# EAGLE design motordriver_output_board_01 (EAGLE 6.5.0)
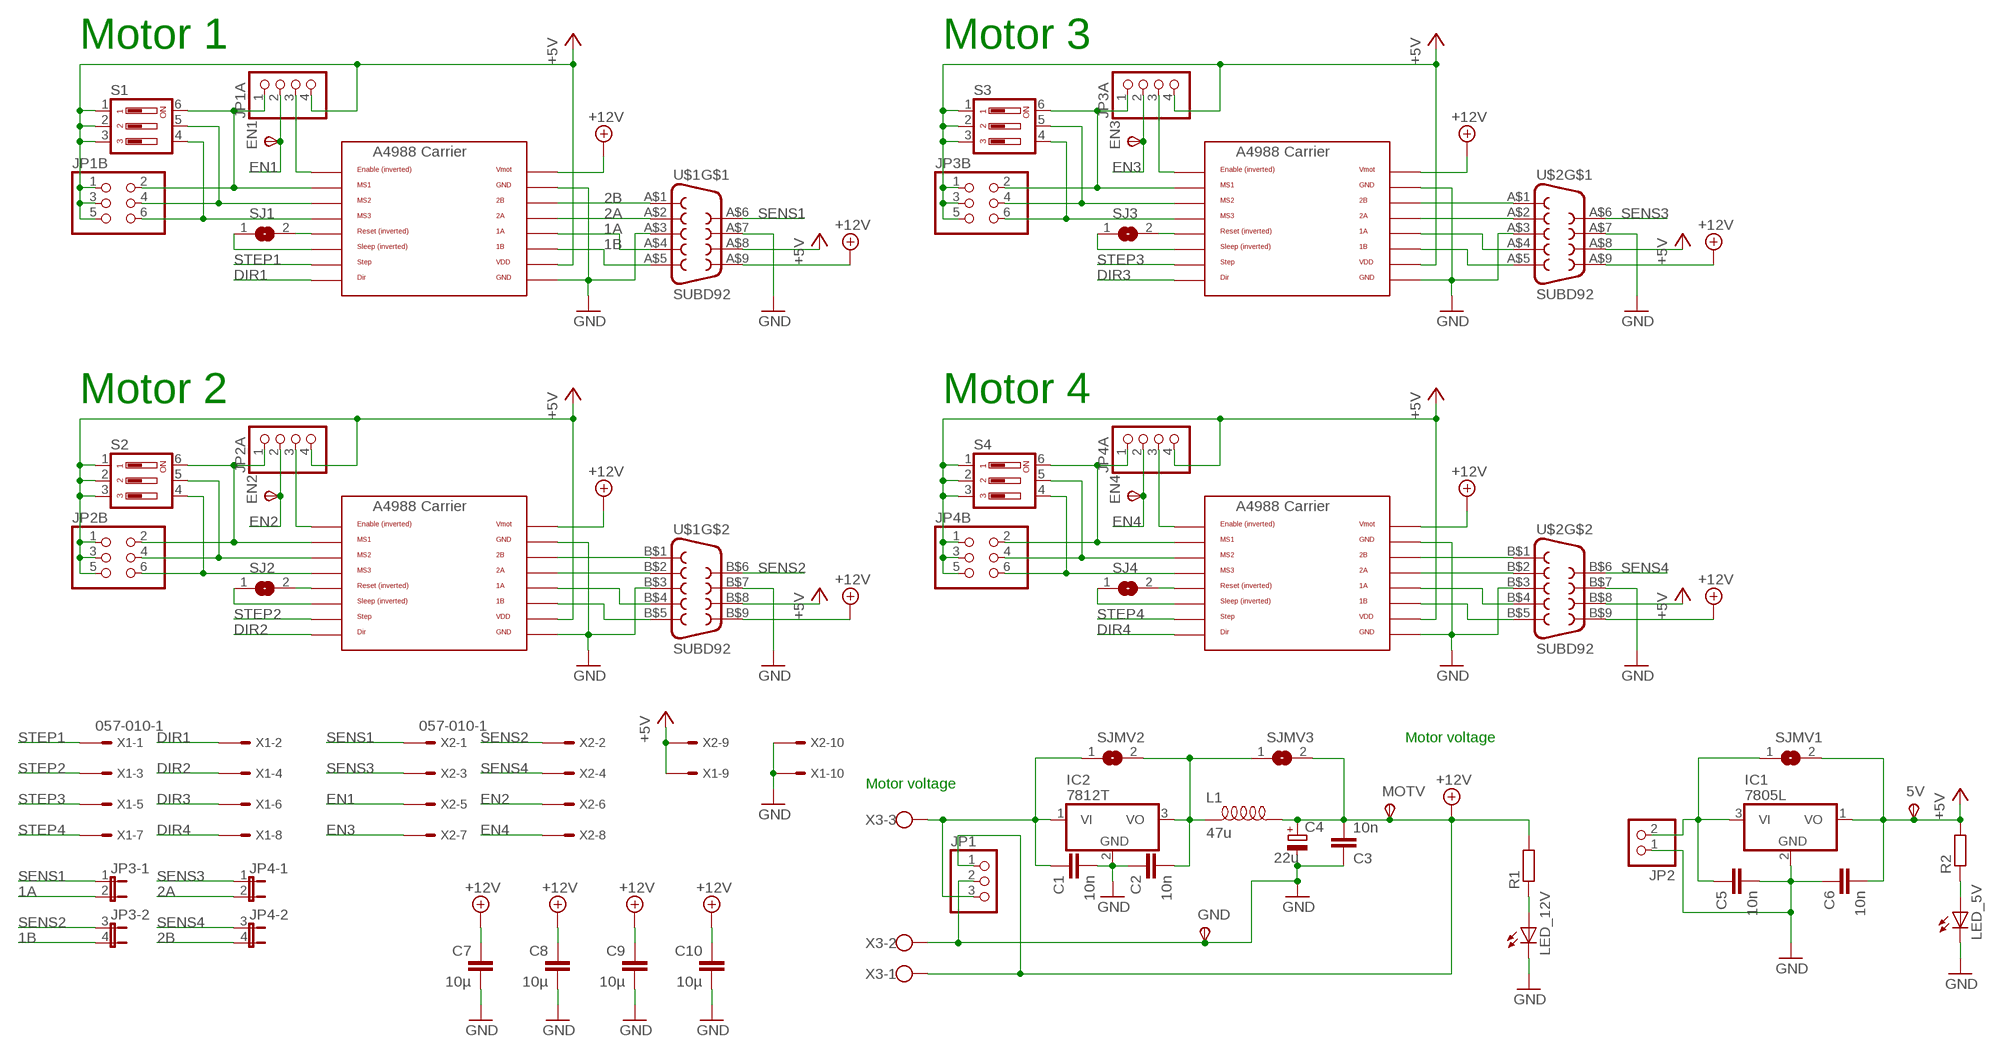
[diagram p0: schematic, sheet 1]

## Parts
5V  TPSPAD1-13  [P1-13]
C1  10n  C-EUC0805  [C0805]
C2  10n  C-EUC0805  [C0805]
C3  10n  C-EUC0805  [C0805]
C4  22u  CPOL-EU153CLV-0605  [153CLV-0605]
C5  10n  C-EUC0805  [C0805]
C6  10n  C-EUC0805  [C0805]
C7  10µ  C-EUC0805  [C0805]
C8  10µ  C-EUC0805  [C0805]
C9  10µ  C-EUC0805  [C0805]
C10  10µ  C-EUC0805  [C0805]
EN1  TPSPAD1-13  [P1-13]
EN2  TPSPAD1-13  [P1-13]
EN3  TPSPAD1-13  [P1-13]
EN4  TPSPAD1-13  [P1-13]
GND  TPSPAD1-13  [P1-13]
IC1  7805L  [TO92]
IC2  7812T  [TO220H]
JP1  PINHD-1X3  [1X03]
JP1A  PINHD-1X4  [1X04]
JP1B  PINHD-2X3  [2X03]
JP2  PINHD-1X2  [1X02]
JP2A  PINHD-1X4  [1X04]
JP2B  PINHD-2X3  [2X03]
JP3  JP2QE  [JP2Q]
JP3A  PINHD-1X4  [1X04]
JP3B  PINHD-2X3  [2X03]
JP4  JP2QE  [JP2Q]
JP4A  PINHD-1X4  [1X04]
JP4B  PINHD-2X3  [2X03]
L1  47u  A814AY-220M  [D10F]
LED_5V  LEDCHIP-LED0805  [CHIP-LED0805]
LED_12V  LEDCHIP-LED0805  [CHIP-LED0805]
MOTDRV1  A4988BREAKOUT  [A4988BREAKOUT]
MOTDRV2  A4988BREAKOUT  [A4988BREAKOUT]
MOTDRV3  A4988BREAKOUT  [A4988BREAKOUT]
MOTDRV4  A4988BREAKOUT  [A4988BREAKOUT]
MOTV  TPSPAD1-13  [P1-13]
R1  R-EU_M0805  [M0805]
R2  R-EU_M0805  [M0805]
S1  DIP03YL  [DIP03YL]
S2  DIP03YL  [DIP03YL]
S3  DIP03YL  [DIP03YL]
S4  DIP03YL  [DIP03YL]
SJ1  SJ  [SJ]
SJ2  SJ  [SJ]
SJ3  SJ  [SJ]
SJ4  SJ  [SJ]
SJMV1  SJW  [SJW]
SJMV2  SJW  [SJW]
SJMV3  SJW  [SJW]
U$1  SUBD92  [SUBD9-2]
U$2  SUBD92  [SUBD9-2]
X1  057-010-1  [057-010-1]
X2  057-010-1  [057-010-1]
X3  W237-103  [W237-103]

## Nets
1A: JP3.2 MOTDRV1.1A U$1.A$4
1A4: MOTDRV4.1A U$2.B$4
1B: JP3.4 MOTDRV1.1B U$1.A$5
1B4: MOTDRV4.1B U$2.B$5
2A: JP4.2 MOTDRV1.2A U$1.A$2
2A4: MOTDRV4.2A U$2.B$2
2B: JP4.4 MOTDRV1.2B U$1.A$1
2B4: MOTDRV4.2B U$2.B$1
+5V: 5V.TP(PP) C6.2 IC1.1(VO) JP1A.4 JP1B.1 JP1B.3 JP1B.5 JP2A.4 JP2B.1 JP2B.3 JP2B.5 JP3A.4 JP3B.1 JP3B.3 JP3B.5 JP4A.4 JP4B.1 JP4B.3 JP4B.5 MOTDRV1.VDD MOTDRV2.VDD MOTDRV3.VDD MOTDRV4.VDD R2.2 S1.1 S1.2 S1.3 S2.1 S2.2 S2.3 S3.1 S3.2 S3.3 S4.1 S4.2 S4.3 SJMV1.2 U$1.A$8 U$1.B$8 U$2.A$8 U$2.B$8 X1.9 X2.9
+12V: C3.2 C4.+ C7.1 C8.1 C9.1 C10.1 JP1.1 L1.2 MOTDRV1.VMOT MOTDRV2.VMOT MOTDRV3.VMOT MOTDRV4.VMOT MOTV.TP(PP) R1.2 SJMV3.2 U$1.A$9 U$1.B$9 U$2.A$9 U$2.B$9 X3.1
DIR1: MOTDRV1.DIR X1.2
DIR2: MOTDRV2.DIR X1.4
DIR3: MOTDRV3.DIR X1.6
DIR4: MOTDRV4.DIR X1.8
EN1: EN1.TP(PP) JP1A.2 X2.5
EN2: EN2.TP(PP) JP2A.2 X2.6
EN3: EN3.TP(PP) JP3A.2 X2.7
EN4: EN4.TP(PP) JP4A.2 X2.8
GND: C1.2 C2.1 C3.1 C4.- C5.2 C6.1 C7.2 C8.2 C9.2 C10.2 GND.TP(PP) IC1.2(GND) IC2.2(GND) JP1.2 JP2.1 LED_5V.C LED_12V.C MOTDRV1.GND MOTDRV1.GND@0(GND) MOTDRV2.GND MOTDRV2.GND@0(GND) MOTDRV3.GND MOTDRV3.GND@0(GND) MOTDRV4.GND MOTDRV4.GND@0(GND) U$1.A$3 U$1.A$7 U$1.B$3 U$1.B$7 U$2.A$3 U$2.A$7 U$2.B$3 U$2.B$7 X1.10 X2.10 X3.2
N$1: MOTDRV2.2B U$1.B$1
N$3: LED_12V.A R1.1
N$4: C5.1 IC1.3(VI) JP2.2 SJMV1.1
N$5: MOTDRV2.2A U$1.B$2
N$6: LED_5V.A R2.1
N$14: C2.2 IC2.3(VO) L1.1 SJMV2.2 SJMV3.1
N$15: MOTDRV2.RST SJ2.2
N$16: JP2A.1 JP2B.2 MOTDRV2.MS1 S2.6
N$19: JP2B.4 MOTDRV2.MS2 S2.5
N$21: JP2B.6 MOTDRV2.MS3 S2.4
N$22: MOTDRV2.1A U$1.B$4
N$23: MOTDRV2.1B U$1.B$5
N$24: MOTDRV2.SLP(SLEEP) SJ2.1
N$25: JP2A.3 MOTDRV2.EN
N$26: MOTDRV3.2B U$2.A$1
N$27: MOTDRV3.2A U$2.A$2
N$32: MOTDRV3.RST SJ3.2
N$33: JP3A.1 JP3B.2 MOTDRV3.MS1 S3.6
N$34: JP3B.4 MOTDRV3.MS2 S3.5
N$35: MOTDRV1.RST SJ1.2
N$36: MOTDRV1.SLP(SLEEP) SJ1.1
N$37: JP3B.6 MOTDRV3.MS3 S3.4
N$38: MOTDRV3.1A U$2.A$4
N$39: MOTDRV3.1B U$2.A$5
N$40: MOTDRV3.SLP(SLEEP) SJ3.1
N$41: JP1A.3 MOTDRV1.EN
N$42: JP3A.3 MOTDRV3.EN
N$45: MOTDRV4.RST SJ4.2
N$47: JP4A.1 JP4B.2 MOTDRV4.MS1 S4.6
N$48: JP4B.4 MOTDRV4.MS2 S4.5
N$49: JP4B.6 MOTDRV4.MS3 S4.4
N$53: MOTDRV4.SLP(SLEEP) SJ4.1
N$54: JP4A.3 MOTDRV4.EN
N$62: JP1A.1 JP1B.2 MOTDRV1.MS1 S1.6
N$63: JP1B.4 MOTDRV1.MS2 S1.5
N$64: JP1B.6 MOTDRV1.MS3 S1.4
N$92: C1.1 IC2.1(VI) JP1.3 SJMV2.1 X3.3
SENS1: JP3.1 U$1.A$6 X2.1
SENS2: JP3.3 U$1.B$6 X2.2
SENS3: JP4.1 U$2.A$6 X2.3
SENS4: JP4.3 U$2.B$6 X2.4
STEP1: MOTDRV1.STEP X1.1
STEP2: MOTDRV2.STEP X1.3
STEP3: MOTDRV3.STEP X1.5
STEP4: MOTDRV4.STEP X1.7

## Notes on the sheet
- Motor 1 | Motor 3
- Motor 2 | Motor 4
- Motor voltage
- Motor voltage

## Library data of the parts
5V EN1-EN4 GND MOTV = testpad:TPS: TEST PIN
C1-C3 C5-C10 = rcl:C-EU: CAPACITOR, European symbol
C4 = rcl:CPOL-EU: POLARIZED CAPACITOR, European symbol
IC1 IC2 = linear:78*: Positive VOLTAGE REGULATOR Source: http://cache.national.com/ds/LM/LM78L05.pdf http://www.fairchildsemi.com/ds/LM/LM7805.pdf
JP1 = pinhead:PINHD-1X3: PIN HEADER
JP1A JP2A JP3A JP4A = pinhead:PINHD-1X4: PIN HEADER
JP1B JP2B JP3B JP4B = pinhead:PINHD-2X3: PIN HEADER
JP2 = pinhead:PINHD-1X2: PIN HEADER
JP3 JP4 = jumper:JP2QE: JUMPER
L1 = inductor-toko:A814AY-220M: SMD 22µF Inductor Toko 2.00A 0.075ohm
LED_5V LED_12V = led:LED: LED OSRAM: - CHIPLED LG R971, LG N971, LY N971, LG Q971, LY Q971, LO R971, LY R971 LH N974, LH R974 LS Q976, LO Q976, LY Q976 LO Q996 - Hyper CHIPLED LW Q18S LB Q993, LB Q99A, LB R99A - SideLED LS A670, LO A670, LY A670, LG A670, LP A670 LB A673, LV A673, LT A673, LW A673 LH A674 LY A675 LS A676, LA A676, LO A676, LY A676, LW A676 LS A679, LY A679, LG A679 - Hyper Micro SIDELED® LS Y876, LA Y876, LO Y876, LY Y876 LT Y87S - SmartLED LW L88C, LW L88S LB L89C, LB L89S, LG L890 LS L89K, LO L89K, LY L89K LS L896, LA L896, LO L896, LY L896 - TOPLED LS T670, LO T670, LY T670, LG T670, LP T670 LSG T670, LSP T670, LSY T670, LOP T670, LYG T670 LG T671, LOG T671, LSG T671 LB T673, LV T673, LT T673, LW T673 LH T674 LS T676, LA T676, LO T676, LY T676, LB T676, LH T676, LSB T676, LW T676 LB T67C, LV T67C, LT T67C, LS T67K, LO T67K, LY T67K, LW E67C LS E67B, LA E67B, LO E67B, LY E67B, LB E67C, LV E67C, LT E67C LW T67C LS T679, LY T679, LG T679 LS T770, LO T770, LY T770, LG T770, LP T770 LB T773, LV T773, LT T773, LW T773 LH T774 LS E675, LA E675, LY E675, LS T675 LS T776, LA T776, LO T776, LY T776, LB T776 LHGB T686 LT T68C, LB T68C - Hyper Mini TOPLED® LB M676 - Mini TOPLED Santana® LG M470 LS M47K, LO M47K, LY M47K Source: http://www.osram.convergy.de LUXEON: - LUMILED® LXK2-PW12-R00, LXK2-PW12-S00, LXK2-PW14-U00, LXK2-PW14-V00 LXK2-PM12-R00, LXK2-PM12-S00, LXK2-PM14-U00 LXK2-PE12-Q00, LXK2-PE12-R00, LXK2-PE12-S00, LXK2-PE14-T00, LXK2-PE14-U00 LXK2-PB12-K00, LXK2-PB12-L00, LXK2-PB12-M00, LXK2-PB14-N00, LXK2-PB14-P00, LXK2-PB14-Q00 LXK2-PR12-L00, LXK2-PR12-M00, LXK2-PR14-Q00, LXK2-PR14-R00 LXK2-PD12-Q00, LXK2-PD12-R00, LXK2-PD12-S00 LXK2-PH12-R00, LXK2-PH12-S00 LXK2-PL12-P00, LXK2-PL12-Q00, LXK2-PL12-R00 Source: www.luxeon.com KINGBRIGHT: KA-3528ASYC Source: www.kingbright.com
MOTDRV1-MOTDRV4 = RepRapjr:A4988BREAKOUT
R1 R2 = rcl:R-EU_: RESISTOR, European symbol
S1-S4 = switch-dil:DIP03YL: DIL/CODE SWITCH; OC_FARNELL: unknown; OC_NEWARK: unknown
SJ1-SJ4 SJMV1-SJMV3 = jumper:SJ: SMD solder JUMPER
U$1 U$2 = 1a_ilja:SUBD92: http://www.emc.de/tl_files/emc/catalog/DS06_DSUB/D_Sub_Dual_Port_90_2fach_mixed/Standard_Ausfuehrung_9-9polig/515272.pdf
X1 X2 = con-panduit:057-010-: CONNECTOR 10-pin series 057 contact pc board low profile headers; OC_FARNELL: unknown; OC_NEWARK: unknown
X3 = con-wago-500:W237-103: WAGO SCREW CLAMP; MPN: 237-103; OC_FARNELL: unknown; OC_NEWARK: 18M7116

## Board
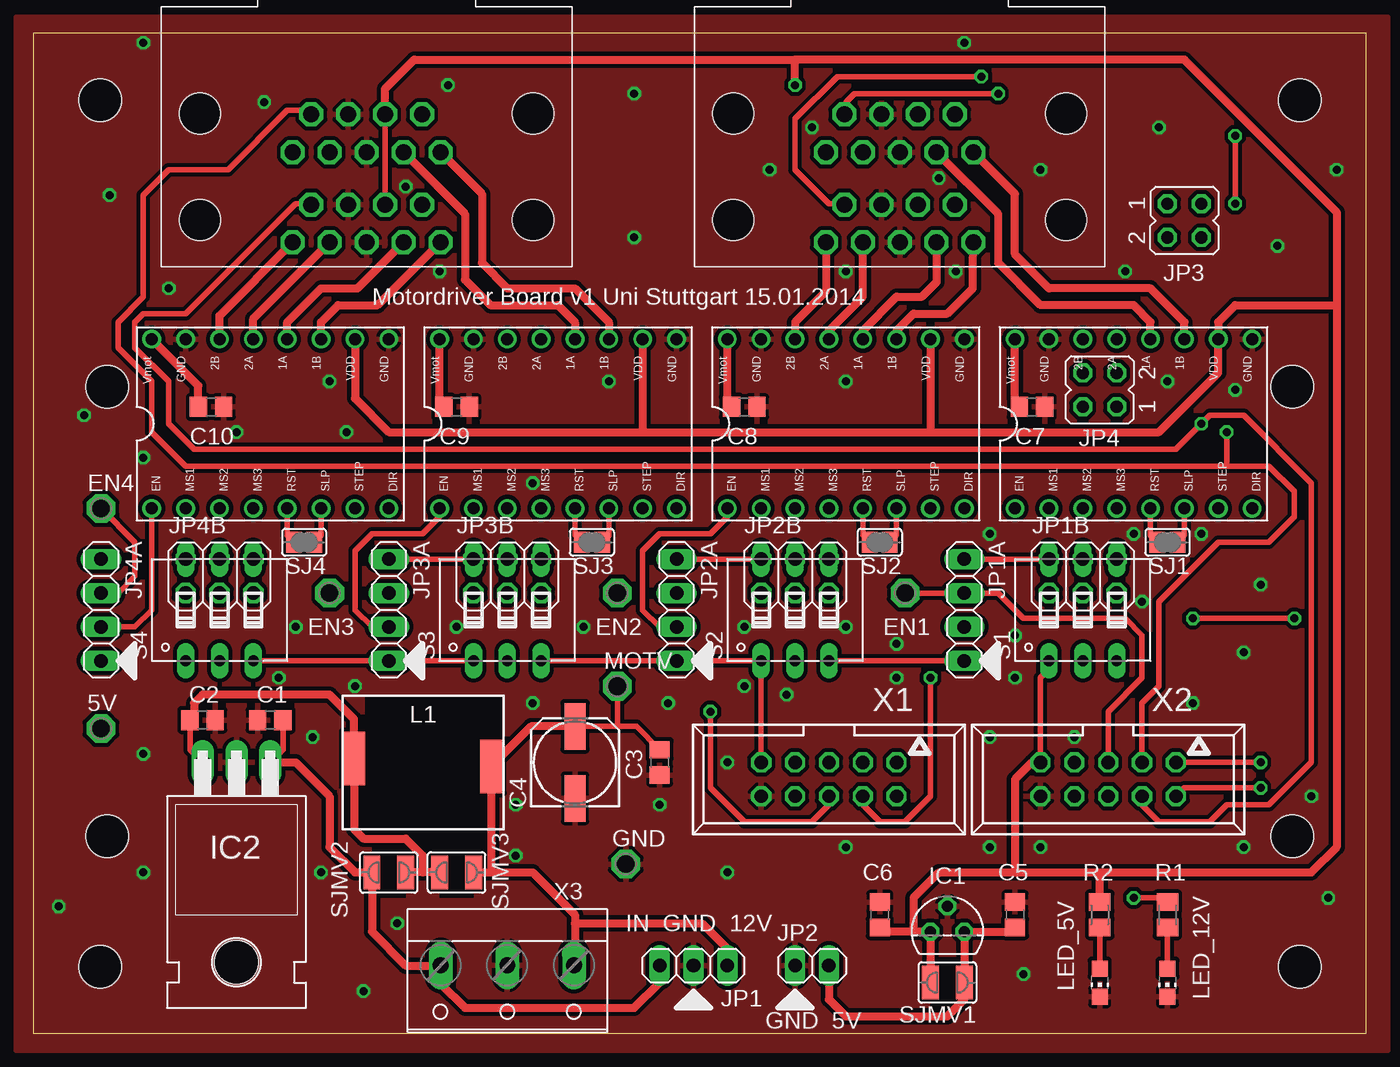
[diagram p1: board, top side]
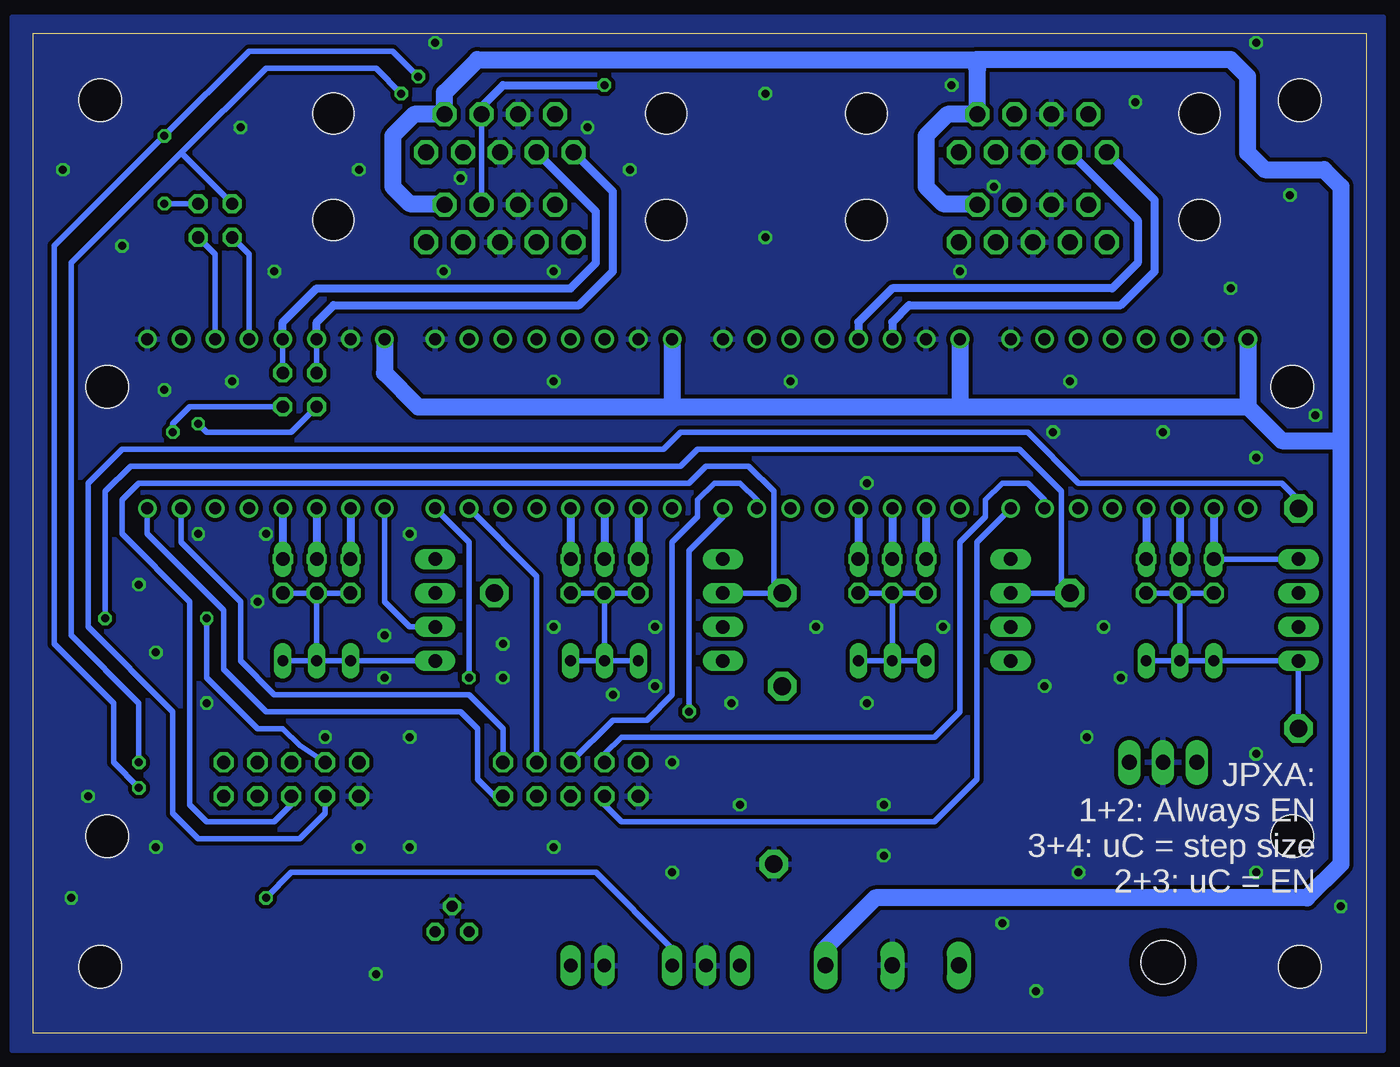
[diagram p2: board, bottom side, seen from below]

Size 100 x 75 mm. Coordinates in mm from the lower left corner, seen from the top.
Outline: 0,0 100,0 100,75 0,75 0,0
Copper layers (1*16): Top 0.035mm / dielectric 1.5mm / Bottom 0.035mm
Design rules "default *": minimum track width 10mil, minimum drill 20mil, track to track 12mil, track to pad 12mil, pad to pad 12mil, via to via 12mil, smd to smd 8mil, copper to edge 0mil, drill to drill 8mil, minimum pad ring 10mil, minimum via ring 8mil, stop-mask expansion 4mil, vias tented up to drill 0mil, thermal gap 10mil
Holes 3.2 mm at 5.55,48.5 94.45,48.5 94.45,14.8 5.55,14.8 5,5 5,70 95,70 95,5
tRestrict: area 25.4,10.2 to 27.9,14; area 30.5,10.2 to 33,14; area 67.3,1.9 to 69.8,5.7

### Footprints (pad centres in the part's own frame; a part is rotated, then mirrored left to right if it is on the bottom)
P1-13 = drill 1.321 pad 2.159 octagon: TP 0,0
C0805 = smd 1.3 x 1.5: 1 -0.95,0; 2 0.95,0
153CLV-0605 = smd 3.5 x 1.6: + 2.7,0; - -2.7,0
TO92 = drill 0.813 octagon: 1 -1.27,0; 2 0,1.905; 3 1.27,0
TO220H = drill 1.118 long: 1 -2.54,-10.16; 2 0,-10.16; 3 2.54,-10.16 | hole 3.302: 0,4.826
1X03 = drill 1.016 long: 1 -2.54,0; 2 0,0; 3 2.54,0
1X04 = drill 1.016 long: 1 -3.81,0; 2 -1.27,0; 3 1.27,0; 4 3.81,0
2X03 = drill 1.016 octagon: 1 -2.54,-1.27; 2 -2.54,1.27; 3 0,-1.27; 4 0,1.27; 5 2.54,-1.27; 6 2.54,1.27
1X02 = drill 1.016 long: 1 -1.27,0; 2 1.27,0
JP2Q = drill 0.914 octagon: 1 -1.27,-1.27; 2 1.27,-1.27; 3 -1.27,1.27; 4 1.27,1.27
D10F = smd 1.7 x 4: 1 -5.15,0.3; 2 5.15,-0.3
CHIP-LED0805 = smd 1.2 x 1.2: A 0,-1.05; C 0,1.05
A4988BREAKOUT = drill 0.9: 1A 8.89,1.27; 1B 11.43,1.27; 2A 6.35,1.27; 2B 3.81,1.27; DIR 16.51,-11.43; EN -1.27,-11.43; GND 16.51,1.27; GND@0 1.27,1.27; MS1 1.27,-11.43; MS2 3.81,-11.43; MS3 6.35,-11.43; RST 8.89,-11.43; SLP 11.43,-11.43; STEP 13.97,-11.43; VDD 13.97,1.27; VMOT -1.27,1.27
M0805 = smd 1.3 x 1.6: 1 -0.95,0; 2 0.95,0
DIP03YL = drill 0.813 long: 1 -2.54,-3.81; 2 0,-3.81; 3 2.54,-3.81; 4 2.54,3.81; 5 0,3.81; 6 -2.54,3.81
SJ = smd 1.168 x 1.6: 1 -0.762,0; 2 0.762,0
SJW = smd 1.27 x 2.54: 1 -1.27,0; 2 1.27,0
SUBD9-2 = drill 1.2 octagon: A$1 5.54,10.92; A$2 2.77,10.92; A$3 0,10.92; A$4 -2.77,10.92; A$5 -5.54,10.92; A$6 4.155,8.08; A$7 1.385,8.08; A$8 -1.385,8.08; A$9 -4.155,8.08; B$1 5.54,17.68; B$2 2.77,17.68; B$3 0,17.68; B$4 -2.77,17.68; B$5 -5.54,17.68; B$6 4.155,14.84; B$7 1.385,14.84; B$8 -1.385,14.84; B$9 -4.155,14.84 | hole 3.1: -12.495,8; -12.495,16; 12.495,8; 12.495,16
057-010-1 = drill 1 octagon: 1 -5.08,-1.27; 2 -5.08,1.27; 3 -2.54,-1.27; 4 -2.54,1.27; 5 0,-1.27; 6 0,1.27; 7 2.54,-1.27; 8 2.54,1.27; 9 5.08,-1.27; 10 5.08,1.27
W237-103 = drill 1.194 long: 1 -5,-1.29; 2 0,-1.29; 3 5,-1.29

### Placement (x,y rotation side)
5V  5.08,22.86 0 top
C1  17.78,23.5 180 top
C2  12.7,23.5 180 top
C3  46.99,20.32 90 top
C4  40.64,20.32 90 top
C5  73.66,8.89 90 top
C6  63.5,8.89 270 top
C7  74.93,46.99 0 top
C8  53.34,46.99 0 top
C9  31.75,46.99 0 top
C10  13.34,46.99 0 top
EN1  65.41,33.02 0 top
EN2  43.81,33.02 0 top
EN3  22.23,33.02 0 top
EN4  5.08,39.37 0 top
GND  44.45,12.7 0 top
IC1  68.58,7.62 0 top
IC2  15.24,10.16 180 top
JP1  49.53,5.08 180 top
JP1A  69.85,31.75 270 top
JP1B  78.74,34.29 0 top
JP2  58.42,5.08 0 top
JP2A  48.26,31.75 270 top
JP2B  57.15,34.29 0 top
JP3  86.36,60.96 270 top
JP3A  26.67,31.75 270 top
JP3B  35.56,34.29 0 top
JP4  80.01,48.26 90 top
JP4A  5.08,31.75 270 top
JP4B  13.97,34.29 0 top
L1  29.21,20.32 0 top
LED_5V  80.01,3.81 180 top
LED_12V  85.09,3.81 180 top
MOTDRV1  74.93,50.8 0 top
MOTDRV2  53.34,50.8 0 top
MOTDRV3  31.75,50.8 0 top
MOTDRV4  10.16,50.8 0 top
MOTV  43.81,26.04 0 top
R1  85.09,8.89 90 top
R2  80.01,8.89 90 top
S1  78.74,31.75 0 top
S2  57.15,31.75 0 top
S3  35.56,31.75 0 top
S4  13.97,31.75 0 top
SJ1  85.09,36.83 180 top
SJ2  63.5,36.83 180 top
SJ3  41.91,36.83 180 top
SJ4  20.32,36.83 180 top
SJMV1  68.58,3.81 180 top
SJMV2  26.67,12.06 0 top
SJMV3  31.75,12.06 0 top
U$1  65,77 180 top
U$2  25,77 180 top
X1  59.69,19.05 180 top
X2  80.64,19.05 180 top
X3  35.56,3.81 180 top

### Tracks (layer width: path | path; a pad name or v marks a point on that pad's centre or on a via)
1A
  Top 0.61: MOTDRV1.1A 83.82,53.34 82.55,54.61 75.56,54.61 72.39,57.78 72.39,61.46 U$1.A$4
  Bottom 0.406: JP3.2 83.82,58.42 MOTDRV1.1A
1A4
  Top 0.61: MOTDRV4.1A 19.05,53.34 21.59,55.88 24.33,55.88 U$2.B$4
1B
  Top 0.61: MOTDRV1.1B 86.36,53.34 83.82,55.88 76.2,55.88 73.66,58.42 73.66,62.96 U$1.A$5
  Bottom 0.406: JP3.4 86.36,58.42 MOTDRV1.1B
1B4
  Top 0.61: MOTDRV4.1B 21.59,53.34 22.86,54.61 25.83,54.61 U$2.B$5
2A
  Bottom 0.406: MOTDRV1.2A JP4.2
  Bottom 0.61: MOTDRV1.2A 81.28,53.34 78.74,55.88 59.69,55.88 57.78,57.78 57.78,61.63 U$1.A$2
2A4
  Top 0.61: MOTDRV4.2A 16.51,53.6 U$2.B$2
2B
  Bottom 0.406: MOTDRV1.2B JP4.4
  Bottom 0.61: MOTDRV1.2B 78.74,53.34 77.47,54.61 59.05,54.61 56.52,57.15 56.52,63.13 U$1.A$1
2B4
  Top 0.61: MOTDRV4.2B 13.97,53.83 U$2.B$1
+5V  (via drill 0.6)
  Top 0.406: S3.1 JP3A.4 S4.3 | X1.9 S2.1 JP2A.4 S3.3 | S2.3 JP1A.4 | 63.5,7.62 C6.2 | 79.69,10.16 R2.2 | S1.1 76.2,27.3 75.56,26.67 X2.9 | U$2.B$8 U$2.A$8
  Top 0.61: SJMV1.2 IC1.1 66.04,7.62 | 66.04,7.62 63.5,7.62 | 97.79,54.61 97.79,61.59 86.36,73.03 57.15,73.03 | 97.79,54.61 97.79,13.97 95.89,12.06 80.01,12.06 | 66.04,7.62 66.04,10.16 67.94,12.06 73.66,12.06 | 73.66,12.06 80.01,12.06 | R2.2 80.01,12.06 | X2.9 74.93,20.32 73.66,19.05 73.66,12.06 | 57.15,73.03 28.57,73.03 26.39,70.83 U$2.A$8 | v57.15,71.12 57.15,73.03 | MOTDRV4.VDD 24.13,47.62 26.67,45.09 45.72,45.09 | 45.72,45.09 67.31,45.09 | MOTDRV2.VDD 67.31,45.09 | MOTDRV3.VDD 45.72,45.09 | 67.31,45.09 84.45,45.09 88.9,49.53 MOTDRV1.VDD 88.9,53.34 90.17,54.61 97.79,54.61
  Bottom 0.406: 5V.TP JP4A.4 S4.1 S4.2 | JP4B.1 JP4B.3 | JP4B.3 JP4B.5 | S4.3 S4.2 | JP4B.3 S4.2 | JP3B.1 JP3B.3 | JP3B.3 S3.2 | JP3B.5 JP3B.3 | S3.3 S3.2 | S3.1 S3.2 | JP2B.1 JP2B.3 | JP2B.3 S2.2 | JP2B.5 JP2B.3 | S2.1 S2.2 | S2.3 S2.2 | JP1B.1 JP1B.3 | JP1B.3 S1.2 | JP1B.3 JP1B.5 | S1.2 S1.3 | S1.2 S1.1 JP1A.4 | U$1.A$8 U$1.B$8
  Bottom 0.61: U$1.A$8 66.39,69.5 64.77,71.12 v57.15,71.12
+12V  (via drill 0.6)
  Top 0.406: C4.+ 43.81,23.02 | 43.81,23.02 45.24,23.02 C3.2 | MOTV.TP 43.81,23.02 | R1.2 85.09,10.16 v82.55,10.16
  Top 0.61: SJMV3.2 34.29,12.06 | 34.29,12.06 37.47,12.06 40.64,8.89 40.64,8.26 | 40.64,8.26 40.64,5.18 X3.1 | 34.29,12.06 34.36,12.13 L1.2 37.36,23.02 C4.+ | 40.64,8.26 50.16,8.26 52.07,6.35 JP1.1 | C10.1 12.38,48.58 MOTDRV4.VMOT | C9.1 30.8,47.3 30.48,47.62 MOTDRV3.VMOT | C8.1 52.07,46.99 MOTDRV2.VMOT | C7.1 73.98,47.3 73.66,47.62 MOTDRV1.VMOT
  Bottom 0.406: v82.55,10.16 80.64,12.06 57.78,12.06 52.07,6.35 JP1.1
  Bottom 0.813: 40.64,5.18 X3.1 | 29.16,72.33 29.21,72.39
  Bottom 1.27: 29.16,72.33 U$2.A$9 31.41,68.92 33.02,67.31 33.02,63.5 31.75,62.23 29.23,62.23 U$2.B$9 | 1.91,44.45 1.91,63.5 3.17,64.77 7.62,64.77 8.89,66.04 8.89,71.75 10.16,73.03 29.21,73.03 | 1.91,44.45 1.91,12.7 4.45,10.16 36.83,10.16 40.64,6.35 40.64,5.18 | MOTDRV3.VMOT 30.48,46.99 | 30.48,46.99 8.89,46.99 | 8.89,46.99 6.35,44.45 1.91,44.45 | MOTDRV4.VMOT 8.89,46.99 | MOTDRV2.VMOT 52.07,46.99 | 52.07,46.99 30.48,46.99 | MOTDRV1.VMOT 73.66,49.53 71.12,46.99 52.07,46.99 | 29.21,73.03 29.21,72.39 | 29.21,73.03 66.67,73.03 69.16,70.55 U$1.A$9 71.42,68.92 73.03,67.31 73.03,63.5 71.75,62.23 69.22,62.23 U$1.B$9
DIR1
  Bottom 0.406: MOTDRV1.DIR 91.44,37.47 85.72,31.75 85.72,27.3 82.55,24.13 67.94,24.13 66.67,22.86 66.67,19.05 65.41,17.78 X1.2
DIR2  (via drill 0.6)
  Top 0.406: X1.4 62.23,17.14 63.5,15.88 65.41,15.88 67.31,17.78 v67.31,26.67
  Bottom 0.406: MOTDRV2.DIR 67.31,36.83 v67.31,26.67
DIR3  (via drill 0.6)
  Top 0.406: v50.8,24.13 50.8,18.41 53.34,15.88 58.42,15.88 59.69,17.14 X1.6
  Bottom 0.406: MOTDRV3.DIR 48.26,38.73 50.8,36.2 v50.8,24.13
DIR4
  Bottom 0.406: X1.8 57.15,17.14 55.88,15.88 32.38,15.88 29.21,19.05 29.21,36.83 MOTDRV4.DIR
EN1
  Top 0.406: EN1.TP JP1A.2 72.39,33.02 74.3,31.11 81.92,31.11 83.19,29.84 83.19,26.67 80.64,24.13 X2.5
EN2
  Bottom 0.406: 46.99,33.02 JP2A.2 EN2.TP 44.45,33.66 44.45,40.64 46.35,42.55 49.53,42.55 50.8,41.27 92.08,41.27 93.34,40.01 93.34,37.47 88.27,32.38 88.27,17.14 87,15.88 81.92,15.88 80.64,17.14 X2.6
EN3  (via drill 0.6)
  Top 0.406: v94.61,31.11 v87,31.11
  Bottom 0.406: 25.4,33.02 JP3A.2 EN3.TP 22.86,33.66 22.86,40.64 26.04,43.81 50.16,43.81 51.44,42.55 92.71,42.55 94.61,40.64 v94.61,31.11 | v87,31.11 87,26.67 83.19,22.86 81.28,22.86 80.01,21.59 X2.7
EN4
  Top 0.406: JP4A.2 6.35,33.02 7.62,34.29 7.62,36.83 EN4.TP
  Bottom 0.406: EN4.TP 5.08,40.01 6.35,41.27 21.59,41.27 25.4,45.09 51.44,45.09 52.7,43.81 93.34,43.81 95.89,41.27 95.89,30.48 89.53,24.13 89.53,16.51 87.63,14.61 80.01,14.61 78.11,16.51 X2.8
GND  (via drill 0.6)
  other vias: 93.34,59.05 84.45,67.94 97.79,64.77 45.09,59.69 17.32,69.85 8.26,74.3 5.71,62.87 15.24,45.09 41.27,30.48 19.68,30.48 64.77,29.21 92.08,33.66 75.56,13.97 74.3,4.45 1.91,9.53 24.77,3.17 90.81,28.57 8.26,20.95 20.95,22.23 56.52,25.4 71.75,22.23 73.66,26.67 73.66,29.84 71.75,37.47 47.62,24.77 37.47,24.77 45.09,70.48 22.23,48.9 95.89,17.78 90.81,13.97 97.16,10.16 71.75,13.97 46.99,17.14 52.07,20.32 43.18,48.9 60.96,48.9 75.56,64.77 55.24,64.77 10.16,55.88 8.26,43.18 8.26,12.06 85.09,48.9 90.17,48.26 23.5,45.09 18.41,26.67 30.48,57.15 69.22,57.15 60.96,57.15 58.42,67.94 31.11,71.12 27.94,63.5 87.63,37.47 83.19,32.38 82.55,37.47 64.77,26.67 53.34,26.04 53.34,30.48 60.96,30.48 31.75,30.48 37.47,41.27 81.92,57.15 67.94,64.14 3.81,46.35 21.59,12.06 27.3,8.26 36.2,13.34 36.2,17.14 24.13,26.04 60.96,13.97 52.07,12.06 78.11,22.23 87,24.77 69.85,74.3
  pour Top: -1.27,-1.27 -1.27,76.2 101.6,76.2 101.6,-1.27
  pour Bottom: -1.27,-1.27 -1.27,76.2 101.6,76.2 101.6,-1.27
N$1
  Top 0.61: U$1.B$1 59.46,55.65 57.15,53.34 MOTDRV2.2B
N$3
  Top 0.406: R1.1 LED_12V.A
N$4
  Top 0.406: 73.66,7.62 C5.1 | 69.85,2.54 SJMV1.1
  Top 0.61: SJMV1.1 IC1.3 73.66,7.62 | JP2.2 59.69,2.54 60.96,1.27 68.58,1.27 69.85,2.54
N$5
  Top 0.61: MOTDRV2.2A 59.69,52.7 62.23,55.24 U$1.B$2
N$6
  Top 0.406: R2.1 LED_5V.A
N$14
  Top 0.406: IC2.3 11.75,21.27 C2.2
  Top 0.61: C2.2 12.06,23.81 12.06,24.77 12.7,25.4 22.23,25.4 24.06,23.57 L1.1 24.06,15.31 24.77,14.61 27.94,14.61 29.21,13.34 29.21,12.06 | 29.21,12.06 SJMV2.2 | SJMV3.1 29.21,12.06
N$15
  Top 0.406: MOTDRV2.RST 62.23,37.34 SJ2.2
N$16
  Top 0.406: JP2A.1 S2.6
  Bottom 0.61: MOTDRV2.MS1 S2.6
N$19
  Bottom 0.61: MOTDRV2.MS2 S2.5
N$21
  Bottom 0.61: MOTDRV2.MS3 S2.4
N$22
  Top 0.61: MOTDRV2.1A 62.23,52.7 64.77,55.24 66.67,55.24 67.77,56.34 U$1.B$4
N$23
  Top 0.61: MOTDRV2.1B 64.77,52.7 66.04,53.98 68.58,53.98 70.48,55.88 70.48,57.2 U$1.B$5
N$24
  Top 0.406: MOTDRV2.SLP 64.77,37.34 SJ2.1
N$25
  Top 0.406: MOTDRV2.EN 52.07,38.73 50.8,37.47 46.99,37.47 45.72,36.2 45.72,31.75 46.99,30.48 JP2A.3
N$26
  Bottom 0.61: U$2.A$1 15.88,62.49 15.88,57.15 18.41,54.61 34.29,54.61 35.56,53.34 MOTDRV3.2B
N$27
  Bottom 0.61: U$2.A$2 17.14,60.99 17.14,57.78 19.05,55.88 35.56,55.88 38.1,53.34 MOTDRV3.2A
N$32
  Top 0.406: MOTDRV3.RST 40.64,37.34 SJ3.2
N$33
  Top 0.406: JP3A.1 S3.6
  Bottom 0.61: MOTDRV3.MS1 S3.6
N$34
  Bottom 0.61: MOTDRV3.MS2 S3.5
N$35
  Top 0.406: MOTDRV1.RST 83.82,37.34 SJ1.2
N$36
  Top 0.406: MOTDRV1.SLP 86.36,37.34 SJ1.1
N$37
  Bottom 0.61: MOTDRV3.MS3 S3.4
N$38
  Top 0.61: U$2.A$4 32.38,61.47 32.38,56.52 34.29,54.61 39.37,54.61 40.64,53.34 MOTDRV3.1A
N$39
  Top 0.61: U$2.A$5 33.66,62.97 33.66,57.78 35.56,55.88 40.64,55.88 43.18,53.34 MOTDRV3.1B
N$40
  Top 0.406: MOTDRV3.SLP 43.18,37.34 SJ3.1
N$41
  Bottom 0.406: MOTDRV1.EN 73.66,32.38 71.75,30.48 JP1A.3
N$42
  Top 0.406: MOTDRV3.EN 30.48,38.73 29.21,37.47 25.4,37.47 24.13,36.2 24.13,31.75 25.4,30.48 JP3A.3
N$45
  Top 0.406: MOTDRV4.RST 19.05,37.34 SJ4.2
N$47
  Bottom 0.406: JP4A.1 S4.6
  Bottom 0.61: MOTDRV4.MS1 S4.6
N$48
  Bottom 0.61: MOTDRV4.MS2 S4.5
N$49
  Bottom 0.61: MOTDRV4.MS3 S4.4
N$53
  Top 0.406: MOTDRV4.SLP 21.59,37.34 SJ4.1
N$54
  Top 0.406: MOTDRV4.EN 8.89,31.75 7.62,30.48 JP4A.3
N$62
  Top 0.406: JP1A.1 S1.6
  Bottom 0.61: MOTDRV1.MS1 S1.6
N$63
  Bottom 0.61: MOTDRV1.MS2 S1.5
N$64
  Bottom 0.61: MOTDRV1.MS3 S1.4
N$92
  Top 0.406: IC2.1 18.73,21.27 C1.1
  Top 0.61: IC2.1 19.68,20.32 22.23,17.78 22.23,13.97 24.13,12.06 SJMV2.1 25.4,7.62 27.94,5.08 30.54,5.08 X3.3 30.56,3.73 32.38,1.91 45.09,1.91 46.99,3.81 JP1.3
SENS1  (via drill 0.6)
  Top 0.406: v92.08,20.32 X2.1 | v72.39,70.48 61.59,70.48 60.96,69.85 60.96,69.03 U$1.A$6
  Bottom 0.406: v92.08,20.32 92.08,24.77 97.16,29.84 97.16,57.78 88.9,66.04 | v72.39,70.48 74.3,72.39 82.55,72.39 88.9,66.04 | JP3.1 88.9,66.04
SENS2  (via drill 0.6)
  Top 0.406: v92.08,18.41 86.36,18.41 X2.2 | v71.12,71.75 60.33,71.75 57.15,68.58 57.15,64.77 59.69,62.23 60.77,62.23 U$1.B$6 | v90.17,62.23 v90.17,67.31
  Bottom 0.406: v92.08,18.41 93.98,20.32 93.98,24.77 98.42,29.21 98.42,59.05 v90.17,67.31 83.82,73.66 73.03,73.66 v71.12,71.75 | JP3.3 v90.17,62.23
SENS3  (via drill 0.6)
  Top 0.406: X2.3 83.19,24.77 84.45,26.04 84.45,32.38 88.9,36.83 92.71,36.83 94.61,38.73 94.61,40.64 92.71,42.55 89.53,42.55 | U$2.A$6 20.55,69.22 19.05,69.22 14.61,64.77 10.16,64.77 8.26,62.87 8.26,55.24 6.35,53.34 6.35,51.44 8.89,48.9 8.89,45.09 11.43,42.55 89.53,42.55 | v89.53,45.09 89.53,42.55
  Bottom 0.406: JP4.1 88.27,46.99 89.53,45.72 v89.53,45.09
SENS4  (via drill 0.6)
  Top 0.406: X2.4 83.19,17.14 84.45,15.88 88.27,15.88 89.53,17.14 92.71,17.14 95.89,20.32 95.89,41.27 90.81,46.35 88.27,46.35 v87.63,45.72 85.72,43.81 12.06,43.81 10.16,45.72 10.16,48.9 7.62,51.44 7.62,53.34 8.26,53.98 11.43,53.98 19.68,62.23 20.77,62.23 U$2.B$6
  Bottom 0.406: JP4.3 80.64,45.09 87,45.09 v87.63,45.72
STEP1
  Bottom 0.406: X1.1 64.77,22.86 67.31,25.4 81.92,25.4 84.45,27.94 84.45,32.38 88.9,36.83 MOTDRV1.STEP
STEP2
  Bottom 0.406: MOTDRV2.STEP 62.23,34.29 X1.3
STEP3
  Bottom 0.406: MOTDRV3.STEP 45.72,40.01 46.99,41.27 48.9,41.27 50.16,40.01 50.16,38.73 52.07,36.83 52.07,25.4 53.98,23.5 56.52,23.5 X1.5
STEP4
  Bottom 0.406: MOTDRV4.STEP 24.13,40.01 25.4,41.27 27.3,41.27 28.57,40.01 28.57,38.73 30.48,36.83 30.48,24.13 32.38,22.23 55.88,22.23 57.15,20.95 X1.7

### Text on the board
tNames: Motordriver Board v1 Uni Stuttgart 15.01.2014 | IN GND 12V | GND 5V
bNames: JPXA: / 1+2: Always EN / 3+4: uC = step size / 2+3: uC = EN